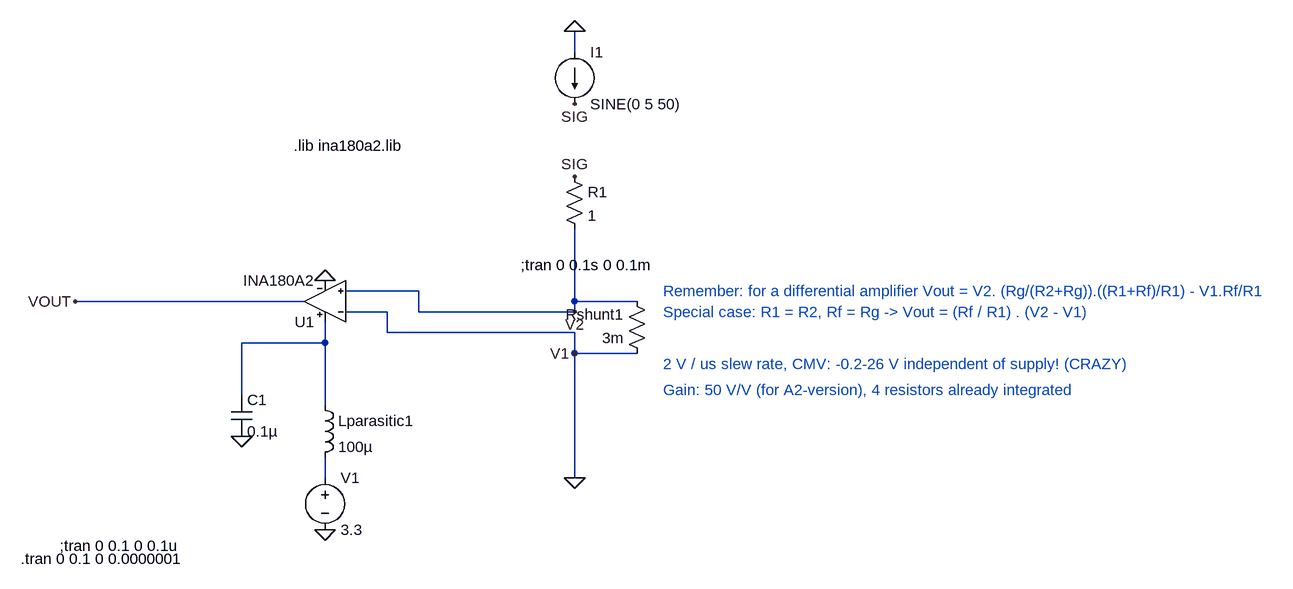
[diagram p0: schematic current_meas_INA180A2.asc]
current_meas_INA180A2.asc, the LTspice schematic file:
Version 4
SHEET 1 1276 732
WIRE 128 -64 128 -96
WIRE -112 304 -224 304
WIRE -288 320 -640 320
WIRE 128 320 128 208
WIRE 224 320 128 320
WIRE -160 336 -224 336
WIRE -112 336 -112 304
WIRE 128 336 128 320
WIRE 128 336 -112 336
WIRE -160 368 -160 336
WIRE 128 368 -160 368
WIRE -256 384 -256 352
WIRE -256 384 -384 384
WIRE 128 400 128 368
WIRE 224 400 128 400
WIRE -384 464 -384 384
WIRE -256 480 -256 384
WIRE -256 592 -256 560
WIRE 128 592 128 400
FLAG 128 -96 0
FLAG 128 592 0
FLAG 128 400 V1
FLAG 128 336 V2
FLAG -256 672 0
FLAG -384 528 0
FLAG -256 288 0
FLAG 128 16 SIG
FLAG 128 128 SIG
FLAG -640 320 VOUT
SYMBOL res 240 416 R180
WINDOW 0 36 76 Left 2
WINDOW 3 36 40 Left 2
SYMATTR InstName Rshunt1
SYMATTR Value 3m
SYMBOL voltage -256 576 R0
WINDOW 123 0 0 Left 0
WINDOW 39 0 0 Left 0
SYMATTR InstName V1
SYMATTR Value 3.3
SYMBOL ind -272 464 R0
SYMATTR InstName Lparasitic1
SYMATTR Value 100µ
SYMBOL cap -400 464 R0
SYMATTR InstName C1
SYMATTR Value 0.1µ
SYMBOL res 112 112 R0
SYMATTR InstName R1
SYMATTR Value 1
SYMBOL OpAmps\\INA180A2 -256 384 R180
SYMATTR InstName U1
SYMBOL current 128 -64 R0
WINDOW 123 0 0 Left 0
WINDOW 39 0 0 Left 0
SYMATTR InstName I1
SYMATTR Value SINE(0 5 50)
TEXT 248 264 Right 2 !;tran 0 0.1s 0 0.1m
TEXT -304 80 Left 2 !.lib ina180a2.lib
TEXT 264 304 Left 2 ;Remember: for a differential amplifier Vout = V2. (Rg/(R2+Rg)).((R1+Rf)/R1) - V1.Rf/R1
TEXT 264 336 Left 2 ;Special case: R1 = R2, Rf = Rg -> Vout = (Rf / R1) . (V2 - V1)
TEXT 264 416 Left 2 ;2 V / us slew rate, CMV: -0.2-26 V independent of supply! (CRAZY)
TEXT 264 456 Left 2 ;Gain: 50 V/V (for A2-version), 4 resistors already integrated
TEXT -664 696 Left 2 !;tran 0 0.1 0 0.1u
TEXT -724 716 Left 2 !.tran 0 0.1 0 0.0000001

The netlist it stands for:
* current_meas_INA180A2.asc
Rshunt1 0 V2 3m
V1 N002 0 3.3
Lparasitic1 N001 N002 100µ
C1 N001 0 0.1µ
R1 SIG V2 1
XU1 V2 0 N001 0 VOUT INA180A2  ; pins INP INN VCC GND OUT
I1 0 SIG SINE(0 5 50)
;tran 0 0.1s 0 0.1m
.lib ina180a2.lib
* Remember: for a differential amplifier Vout = V2. (Rg/(R2+Rg)).((R1+Rf)/R1) - V1.Rf/R1
* Special case: R1 = R2, Rf = Rg -> Vout = (Rf / R1) . (V2 - V1)
* 2 V / us slew rate, CMV: -0.2-26 V independent of supply! (CRAZY)
* Gain: 50 V/V (for A2-version), 4 resistors already integrated
;tran 0 0.1 0 0.1u
.tran 0 0.1 0 0.0000001
.backanno
.end